# EAGLE schematic 549-teletouch-sensor (EAGLE 8.0.0)
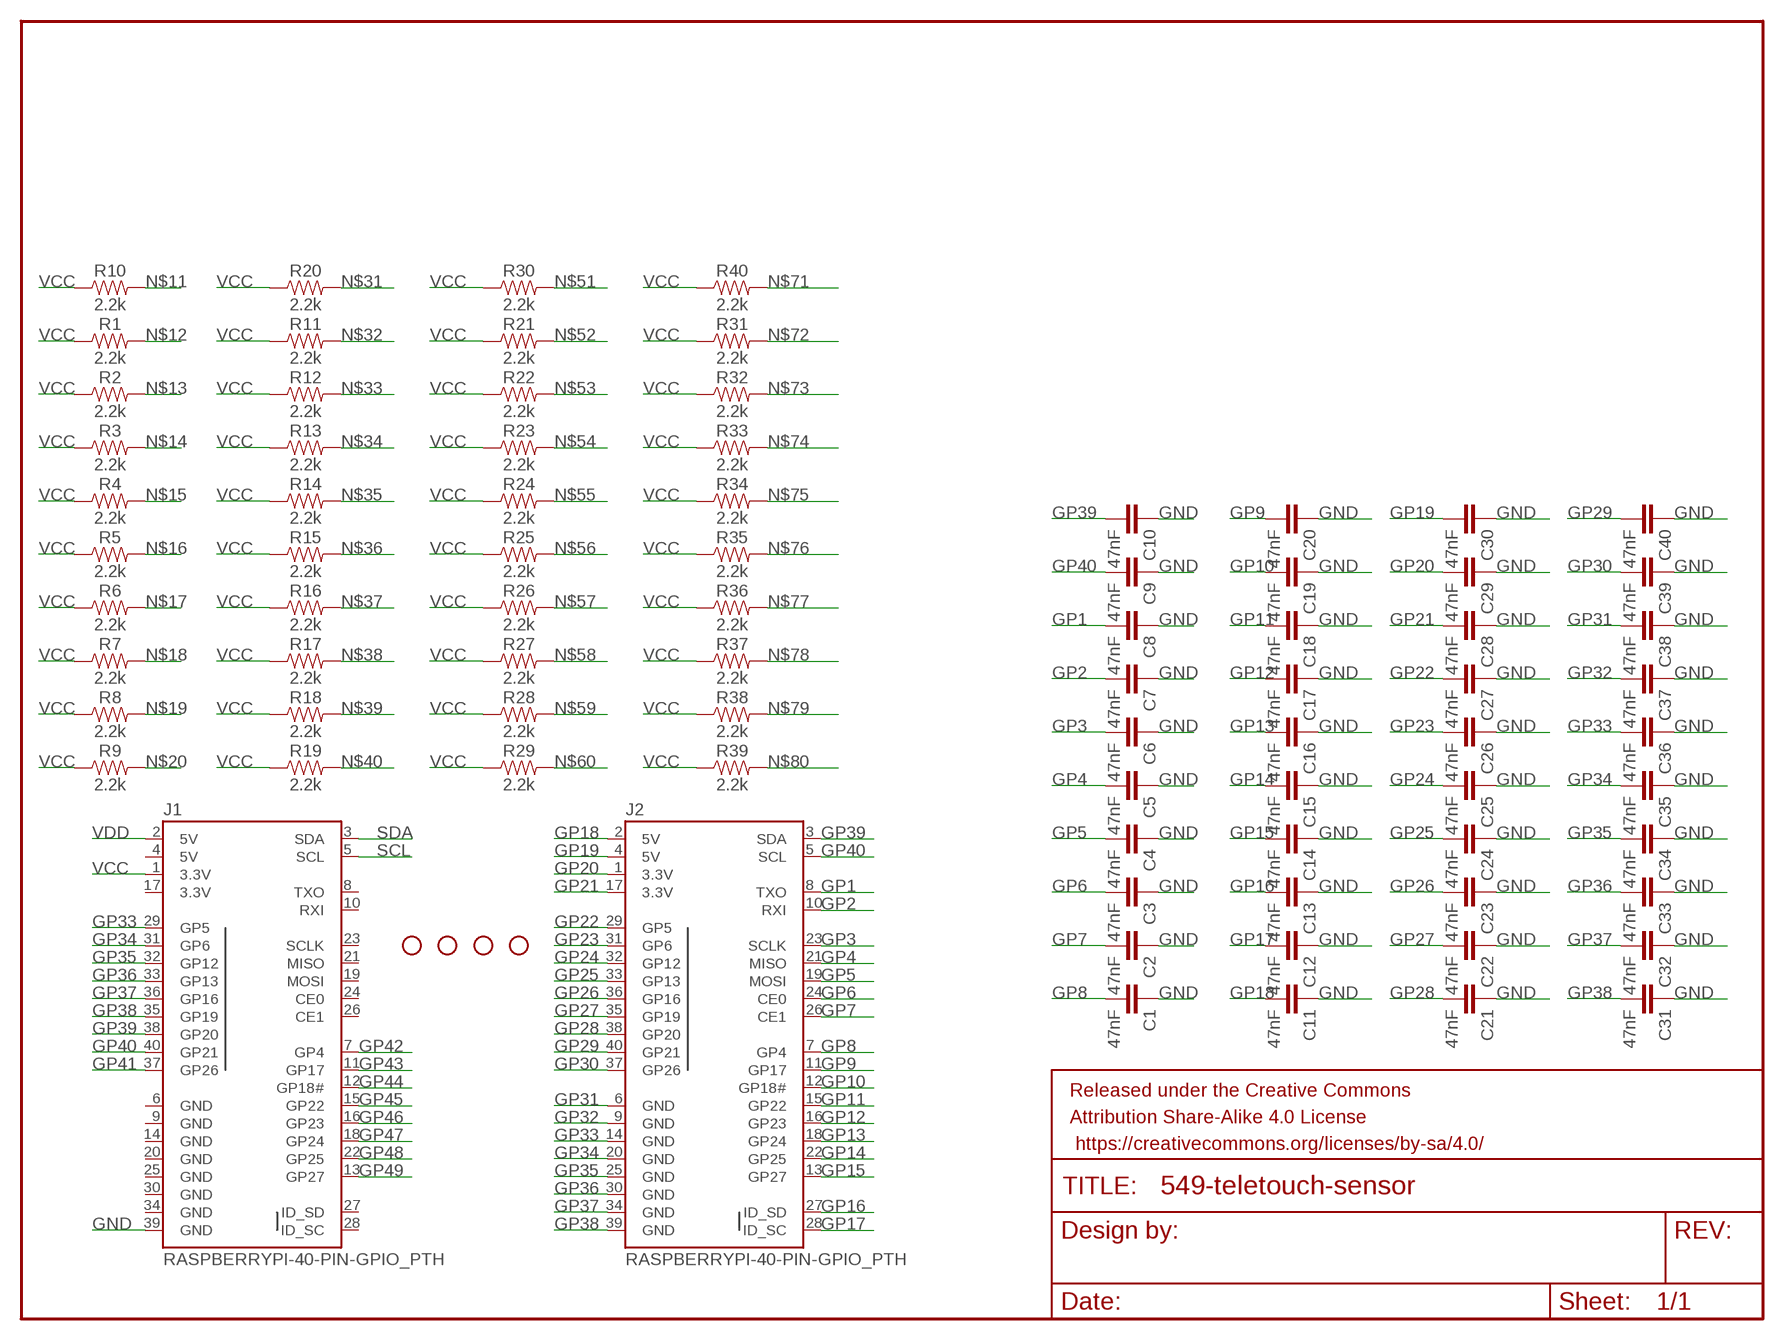
[diagram p0: schematic, sheet 1]

## Parts
C1  47nF  47NF-0603-25V-5%  [0603]
C2  47nF  47NF-0603-25V-5%  [0603]
C3  47nF  47NF-0603-25V-5%  [0603]
C4  47nF  47NF-0603-25V-5%  [0603]
C5  47nF  47NF-0603-25V-5%  [0603]
C6  47nF  47NF-0603-25V-5%  [0603]
C7  47nF  47NF-0603-25V-5%  [0603]
C8  47nF  47NF-0603-25V-5%  [0603]
C9  47nF  47NF-0603-25V-5%  [0603]
C10  47nF  47NF-0603-25V-5%  [0603]
C11  47nF  47NF-0603-25V-5%  [0603]
C12  47nF  47NF-0603-25V-5%  [0603]
C13  47nF  47NF-0603-25V-5%  [0603]
C14  47nF  47NF-0603-25V-5%  [0603]
C15  47nF  47NF-0603-25V-5%  [0603]
C16  47nF  47NF-0603-25V-5%  [0603]
C17  47nF  47NF-0603-25V-5%  [0603]
C18  47nF  47NF-0603-25V-5%  [0603]
C19  47nF  47NF-0603-25V-5%  [0603]
C20  47nF  47NF-0603-25V-5%  [0603]
C21  47nF  47NF-0603-25V-5%  [0603]
C22  47nF  47NF-0603-25V-5%  [0603]
C23  47nF  47NF-0603-25V-5%  [0603]
C24  47nF  47NF-0603-25V-5%  [0603]
C25  47nF  47NF-0603-25V-5%  [0603]
C26  47nF  47NF-0603-25V-5%  [0603]
C27  47nF  47NF-0603-25V-5%  [0603]
C28  47nF  47NF-0603-25V-5%  [0603]
C29  47nF  47NF-0603-25V-5%  [0603]
C30  47nF  47NF-0603-25V-5%  [0603]
C31  47nF  47NF-0603-25V-5%  [0603]
C32  47nF  47NF-0603-25V-5%  [0603]
C33  47nF  47NF-0603-25V-5%  [0603]
C34  47nF  47NF-0603-25V-5%  [0603]
C35  47nF  47NF-0603-25V-5%  [0603]
C36  47nF  47NF-0603-25V-5%  [0603]
C37  47nF  47NF-0603-25V-5%  [0603]
C38  47nF  47NF-0603-25V-5%  [0603]
C39  47nF  47NF-0603-25V-5%  [0603]
C40  47nF  47NF-0603-25V-5%  [0603]
FRAME1  FRAME-LETTER  [CREATIVE_COMMONS]
H1  STAND-OFF  [STAND-OFF]
H2  STAND-OFF  [STAND-OFF]
H3  STAND-OFF  [STAND-OFF]
H4  STAND-OFF  [STAND-OFF]
J1  RASPBERRYPI-40-PIN-GPIO_PTH  [2X20_SHROUDED]
J2  RASPBERRYPI-40-PIN-GPIO_PTH  [2X20_SHROUDED]
R1  2.2k  2.2KOHM-0603-1/10W-1%  [0603]
R2  2.2k  2.2KOHM-0603-1/10W-1%  [0603]
R3  2.2k  2.2KOHM-0603-1/10W-1%  [0603]
R4  2.2k  2.2KOHM-0603-1/10W-1%  [0603]
R5  2.2k  2.2KOHM-0603-1/10W-1%  [0603]
R6  2.2k  2.2KOHM-0603-1/10W-1%  [0603]
R7  2.2k  2.2KOHM-0603-1/10W-1%  [0603]
R8  2.2k  2.2KOHM-0603-1/10W-1%  [0603]
R9  2.2k  2.2KOHM-0603-1/10W-1%  [0603]
R10  2.2k  2.2KOHM-0603-1/10W-1%  [0603]
R11  2.2k  2.2KOHM-0603-1/10W-1%  [0603]
R12  2.2k  2.2KOHM-0603-1/10W-1%  [0603]
R13  2.2k  2.2KOHM-0603-1/10W-1%  [0603]
R14  2.2k  2.2KOHM-0603-1/10W-1%  [0603]
R15  2.2k  2.2KOHM-0603-1/10W-1%  [0603]
R16  2.2k  2.2KOHM-0603-1/10W-1%  [0603]
R17  2.2k  2.2KOHM-0603-1/10W-1%  [0603]
R18  2.2k  2.2KOHM-0603-1/10W-1%  [0603]
R19  2.2k  2.2KOHM-0603-1/10W-1%  [0603]
R20  2.2k  2.2KOHM-0603-1/10W-1%  [0603]
R21  2.2k  2.2KOHM-0603-1/10W-1%  [0603]
R22  2.2k  2.2KOHM-0603-1/10W-1%  [0603]
R23  2.2k  2.2KOHM-0603-1/10W-1%  [0603]
R24  2.2k  2.2KOHM-0603-1/10W-1%  [0603]
R25  2.2k  2.2KOHM-0603-1/10W-1%  [0603]
R26  2.2k  2.2KOHM-0603-1/10W-1%  [0603]
R27  2.2k  2.2KOHM-0603-1/10W-1%  [0603]
R28  2.2k  2.2KOHM-0603-1/10W-1%  [0603]
R29  2.2k  2.2KOHM-0603-1/10W-1%  [0603]
R30  2.2k  2.2KOHM-0603-1/10W-1%  [0603]
R31  2.2k  2.2KOHM-0603-1/10W-1%  [0603]
R32  2.2k  2.2KOHM-0603-1/10W-1%  [0603]
R33  2.2k  2.2KOHM-0603-1/10W-1%  [0603]
R34  2.2k  2.2KOHM-0603-1/10W-1%  [0603]
R35  2.2k  2.2KOHM-0603-1/10W-1%  [0603]
R36  2.2k  2.2KOHM-0603-1/10W-1%  [0603]
R37  2.2k  2.2KOHM-0603-1/10W-1%  [0603]
R38  2.2k  2.2KOHM-0603-1/10W-1%  [0603]
R39  2.2k  2.2KOHM-0603-1/10W-1%  [0603]
R40  2.2k  2.2KOHM-0603-1/10W-1%  [0603]

## Nets
GND: C1.1 C2.1 C3.1 C4.1 C5.1 C6.1 C7.1 C8.1 C9.1 C10.1 C11.1 C12.1 C13.1 C14.1 C15.1 C16.1 C17.1 C18.1 C19.1 C20.1 C21.1 C22.1 C23.1 C24.1 C25.1 C26.1 C27.1 C28.1 C29.1 C30.1 C31.1 C32.1 C33.1 C34.1 C35.1 C36.1 C37.1 C38.1 C39.1 C40.1 J1.39(GND)
GP1: C8.2 J2.8(TXO)
GP2: C7.2 J2.10(RXI)
GP3: C6.2 J2.23(SCLK)
GP4: C5.2 J2.21(MISO)
GP5: C4.2 J2.19(MOSI)
GP6: C3.2 J2.24(CE0)
GP7: C2.2 J2.26(CE1)
GP8: C1.2 J2.7(GP4)
GP9: C20.2 J2.11(GP17)
GP10: C19.2 J2.12(GP18#)
GP11: C18.2 J2.15(GP22)
GP12: C17.2 J2.16(GP23)
GP13: C16.2 J2.18(GP24)
GP14: C15.2 J2.22(GP25)
GP15: C14.2 J2.13(GP27)
GP16: C13.2 J2.27(ID_SD)
GP17: C12.2 J2.28(ID_SC)
GP18: C11.2 J2.2(5V)
GP19: C30.2 J2.4(5V)
GP20: C29.2 J2.1(3.3V)
GP21: C28.2 J2.17(3.3V)
GP22: C27.2 J2.29(GP5)
GP23: C26.2 J2.31(GP6)
GP24: C25.2 J2.32(GP12)
GP25: C24.2 J2.33(GP13)
GP26: C23.2 J2.36(GP16)
GP27: C22.2 J2.35(GP19)
GP28: C21.2 J2.38(GP20)
GP29: C40.2 J2.40(GP21)
GP30: C39.2 J2.37(GP26)
GP31: C38.2 J2.6(GND)
GP32: C37.2 J2.9(GND)
GP33: C36.2 J1.29(GP5) J2.14(GND)
GP34: C35.2 J1.31(GP6) J2.20(GND)
GP35: C34.2 J1.32(GP12) J2.25(GND)
GP36: C33.2 J1.33(GP13) J2.30(GND)
GP37: C32.2 J1.36(GP16) J2.34(GND)
GP38: C31.2 J1.35(GP19) J2.39(GND)
GP39: C10.2 J1.38(GP20) J2.3(SDA)
GP40: C9.2 J1.40(GP21) J2.5(SCL)
GP41: J1.37(GP26)
GP42: J1.7(GP4)
GP43: J1.11(GP17)
GP44: J1.12(GP18#)
GP45: J1.15(GP22)
GP46: J1.16(GP23)
GP47: J1.18(GP24)
GP48: J1.22(GP25)
GP49: J1.13(GP27)
N$11: R10.2
N$12: R1.2
N$13: R2.2
N$14: R3.2
N$15: R4.2
N$16: R5.2
N$17: R6.2
N$18: R7.2
N$19: R8.2
N$20: R9.2
N$31: R20.2
N$32: R11.2
N$33: R12.2
N$34: R13.2
N$35: R14.2
N$36: R15.2
N$37: R16.2
N$38: R17.2
N$39: R18.2
N$40: R19.2
N$51: R30.2
N$52: R21.2
N$53: R22.2
N$54: R23.2
N$55: R24.2
N$56: R25.2
N$57: R26.2
N$58: R27.2
N$59: R28.2
N$60: R29.2
N$71: R40.2
N$72: R31.2
N$73: R32.2
N$74: R33.2
N$75: R34.2
N$76: R35.2
N$77: R36.2
N$78: R37.2
N$79: R38.2
N$80: R39.2
SCL: J1.5(SCL)
SDA: J1.3(SDA)
VCC: J1.1(3.3V) R1.1 R2.1 R3.1 R4.1 R5.1 R6.1 R7.1 R8.1 R9.1 R10.1 R11.1 R12.1 R13.1 R14.1 R15.1 R16.1 R17.1 R18.1 R19.1 R20.1 R21.1 R22.1 R23.1 R24.1 R25.1 R26.1 R27.1 R28.1 R29.1 R30.1 R31.1 R32.1 R33.1 R34.1 R35.1 R36.1 R37.1 R38.1 R39.1 R40.1
VDD: J1.2(5V)
Unconnected: J1.8(TXO) J1.10(RXI) J1.19(MOSI) J1.21(MISO) J1.23(SCLK) J1.24(CE0) J1.26(CE1) J1.27(ID_SD) J1.28(ID_SC)

## Power pins joined to a net without a drawn wire
3.3V: J1.17(3.3V)
5V: J1.4(5V)
GND: J1.6(GND) J1.9(GND) J1.14(GND) J1.20(GND) J1.25(GND) J1.30(GND) J1.34(GND)

## Library data of the parts
C1-C40 = SparkFun-Capacitors:47NF: 47nF ceramic capacitors A capacitor is a passive two-terminal electrical component used to store electrical energy temporarily in an electric field.; PROD_ID: CAP-08605
FRAME1 = SparkFun-Aesthetics:FRAME-LETTER: Schematic Frame - Letter Standard 8.5x11 US Letter frame
H1-H4 = SparkFun-Hardware:STAND-OFF: Stand Off Drill holes for mechanically mounting via screws, standoffs, etc. Note: Use the keepout ring to avoid running the screw head into surrounding components. Variant Overviews STAND-OFF - Mechanical footprint for a #4 phillips button head screw. STAND-OFF-TIGHT - Mechanical footprint for a #4 phillips button head screw, Example SparkFun Products Screw - Phillips Head (1/4", 4-40, 10 pack) <https://www.sparkfun.com/products/10453> (PRT-10453) Screw - Phillips Head (1/2", 4-40, 10 pack) <https://www.sparkfun.com/products/10452> (PRT-10452) Screw - Phillips Head (3/4", 4-40, 10 pack) <https://www.sparkfun.com/products/10451> (PRT-10451) Screw - Phillips Head (1", 4-40, 10 pack) <https://www.sparkfun.com/products/10450> (PRT-10450)
J1 J2 = SparkFun-Connectors:RASPBERRYPI-40-PIN-GPIO: Raspberry Pi GPIO Header 2x20 pin connector, as found on B, B+, A+ models. Both shrouded PTH and SMT versions available. SparkFun Products: GPIO Shrouded Header <https://www.sparkfun.com/products/13054>- PTH SparkFun Pi Wedge (Preassembled) <https://www.sparkfun.com/products/13717>; PROD_ID: CONN-12263; SF_ID: PRT-13054
R1-R40 = SparkFun-Resistors:2.2KOHM: 2.2kΩ resistor A resistor is a passive two-terminal electrical component that implements electrical resistance as a circuit element. Resistors act to reduce current flow, and, at the same time, act to lower voltage levels within circuits. - Wikipedia; PROD_ID: RES-08272